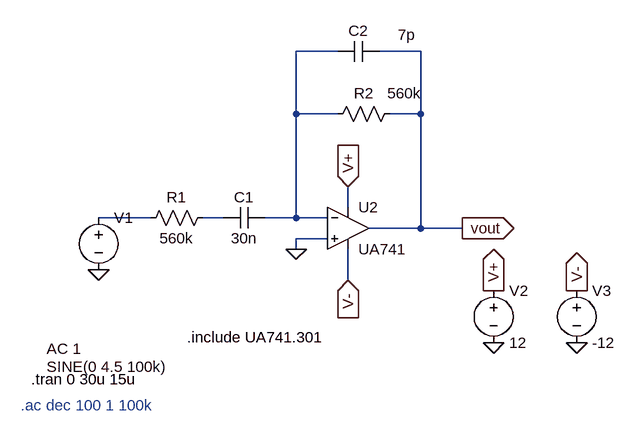
[diagram p0: schematic filter.asc]
filter.asc, the LTspice schematic file:
Version 4
SHEET 1 1184 680
WIRE 288 -128 224 -128
WIRE 416 -128 352 -128
WIRE 224 -32 224 -128
WIRE 288 -32 224 -32
WIRE 416 -32 416 -128
WIRE 416 -32 368 -32
WIRE 304 112 304 80
WIRE 0 128 -80 128
WIRE 112 128 80 128
WIRE 224 128 224 -32
WIRE 224 128 176 128
WIRE 272 128 224 128
WIRE 416 144 416 -32
WIRE 416 144 336 144
WIRE 480 144 416 144
WIRE 272 160 224 160
WIRE 224 176 224 160
WIRE 304 224 304 176
FLAG -80 208 0
FLAG 224 176 0
FLAG 528 320 0
FLAG 656 320 0
FLAG 528 240 V+
IOPIN 528 240 Out
FLAG 656 240 V-
IOPIN 656 240 Out
FLAG 304 80 V+
IOPIN 304 80 In
FLAG 304 224 V-
IOPIN 304 224 In
FLAG 480 144 vout
IOPIN 480 144 Out
DATAFLAG 512 160 ""
SYMBOL voltage -80 112 R0
WINDOW 123 -80 217 Left 2
WINDOW 39 0 0 Left 0
WINDOW 3 -80 245 Left 2
SYMATTR Value2 AC 1
SYMATTR Value SINE(0 4.5 100k)
SYMATTR InstName V1
SYMBOL res 96 112 R90
WINDOW 0 0 56 VBottom 2
WINDOW 3 32 56 VTop 2
SYMATTR InstName R1
SYMATTR Value 560k
SYMBOL cap 176 112 R90
WINDOW 0 0 32 VBottom 2
WINDOW 3 32 32 VTop 2
SYMATTR InstName C1
SYMATTR Value 30n
SYMBOL voltage 528 224 R0
SYMATTR InstName V2
SYMATTR Value 12
SYMBOL voltage 656 224 R0
SYMATTR InstName V3
SYMATTR Value -12
SYMBOL res 384 -48 R90
WINDOW 0 0 56 VBottom 2
WINDOW 3 -31 -7 VTop 2
SYMATTR InstName R2
SYMATTR Value 560k
SYMBOL cap 352 -144 R90
WINDOW 0 0 32 VBottom 2
WINDOW 3 -25 -42 VTop 2
SYMATTR InstName C2
SYMATTR Value 7p
SYMBOL OpAmps\\opamp2 304 80 R0
SYMATTR InstName U2
SYMATTR Value UA741
TEXT -200 416 Left 2 ;.ac dec 100 1 100k
TEXT -184 376 Left 2 !.tran 0 30u 15u
TEXT 56 312 Left 2 !.include UA741.301

The netlist it stands for:
* filter.asc
V1 N002 0 SINE(0 4.5 100k) AC 1
R1 N003 N002 560k
C1 N001 N003 30n
V2 V+ 0 12
V3 V- 0 -12
R2 vout N001 560k
C2 vout N001 7p
XU2 0 N001 V+ V- vout UA741  ; pins In+ In- V+ V- OUT
* .ac dec 100 1 100k
.tran 0 30u 15u
.include UA741.301
.backanno
.end